# Altium schematic sheet CC8520_simple.SchDoc
size A4
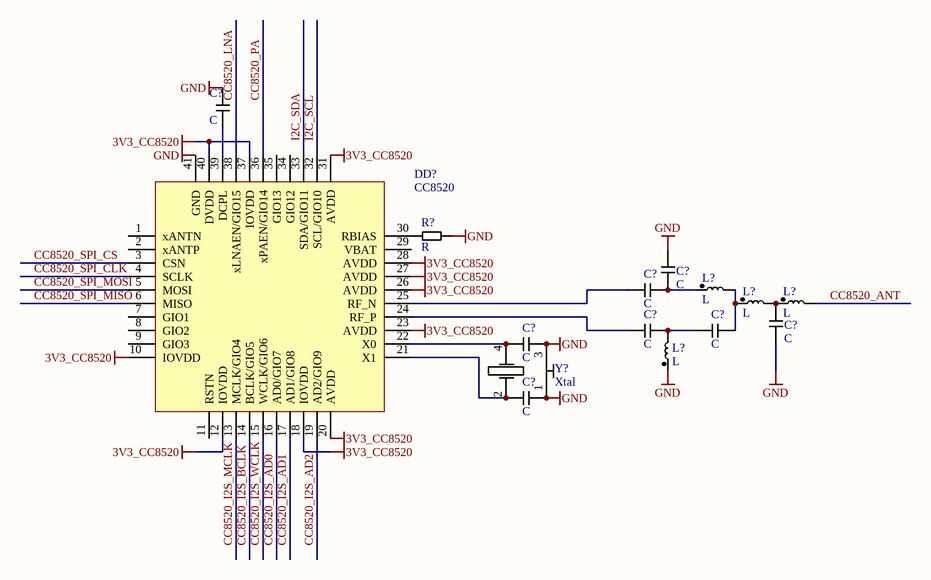
[diagram p0: CC8520_simple.SchDoc]

## Parts
(Parts that share a designator on the sheet are numbered #1, #2 ... from top to bottom, then left to right.)
C?#1  C  [C0402]
C?#2  C  [C0402]
C?#3  C  [C0402]
C?#4  C  [C0402]
C?#5  C  [C0402]
C?#6  C  [C0402]
C?#7  C  [C0402]
C?#8  C  [C0402]
DD?  CC8520  [QFN-40]
L?#1  L  [L0402]
L?#2  L  [L0402]
L?#3  L  [L0402]
L?#4  L  [L0402]
R?  R  [R0402]
Y?  Xtal  [XTAL 2016]

## Nets
3V3_CC8520: DD?.10(IOVDD) DD?.12(IOVDD) DD?.18(IOVDD) DD?.20(AVDD) DD?.23(AVDD) DD?.26(AVDD) DD?.27(AVDD) DD?.28(AVDD) DD?.31(AVDD) DD?.37(IOVDD) DD?.40(DVDD)
GND: C?#1.1 C?#2.1 C?#4.2 C?#7.2 C?#8.2 DD?.41(GND) L?#4.1 R?.2 Y?.1(X1) Y?.3(X2)
CC8520_ANT: L?#3.2
CC8520_I2S_AD0: DD?.16(AD0/GIO7)
CC8520_I2S_AD1: DD?.17(AD1/GIO8)
CC8520_I2S_AD2: DD?.19(AD2/GIO9)
CC8520_I2S_BCLK: DD?.14(BCLK/GIO5)
CC8520_I2S_MCLK: DD?.13(MCLK/GIO4)
CC8520_I2S_WCLK: DD?.15(WCLK/GIO6)
CC8520_LNA: DD?.38(xLNAEN/GIO15)
CC8520_PA: DD?.36(xPAEN/GIO14)
CC8520_SPI_CLK: DD?.4(SCLK)
CC8520_SPI_CS: DD?.3(CSN)
CC8520_SPI_MISO: DD?.6(MISO)
CC8520_SPI_MOSI: DD?.5(MOSI)
I2C_SCL: DD?.32(SCL/GIO10)
I2C_SDA: DD?.33(SDA/GIO11)
NetC?#1_2: C?#1.2 DD?.39(DCPL)
NetC?#2_2: C?#2.2 C?#3.2 L?#1.1
NetC?#3_1: C?#3.1 DD?.25(RF_N)
NetC?#4_1: C?#4.1 L?#2.2 L?#3.1
NetC?#5_1: C?#5.1 DD?.24(RF_P)
NetC?#5_2: C?#5.2 C?#6.1 L?#4.2
NetC?#6_2: C?#6.2 L?#1.2 L?#2.1
NetC?#7_1: C?#7.1 DD?.22(X0) Y?.4(GND)
NetC?#8_1: C?#8.1 DD?.21(X1) Y?.2(GND)
NetDD?_30: DD?.30(RBIAS) R?.1

Not connected (* = marked no-connect by the designer): DD? 1(xANTN) 2(xANTP) 7(GIO1) 8(GIO2) 9(GIO3) 11(RSTN) 29(VBAT) 34(GIO12) 35(GIO13)

## Library data of the parts
C?#1-C?#8 = C: Capacitor
DD? = CC8520: TI Wireless Audio tranciever
L?#1-L?#4 = L: Inductor
R? = R: Resistor
Y? = Xtal: Quartz crystal